# EAGLE design Audio-DAC-D (EAGLE 9.6.1)
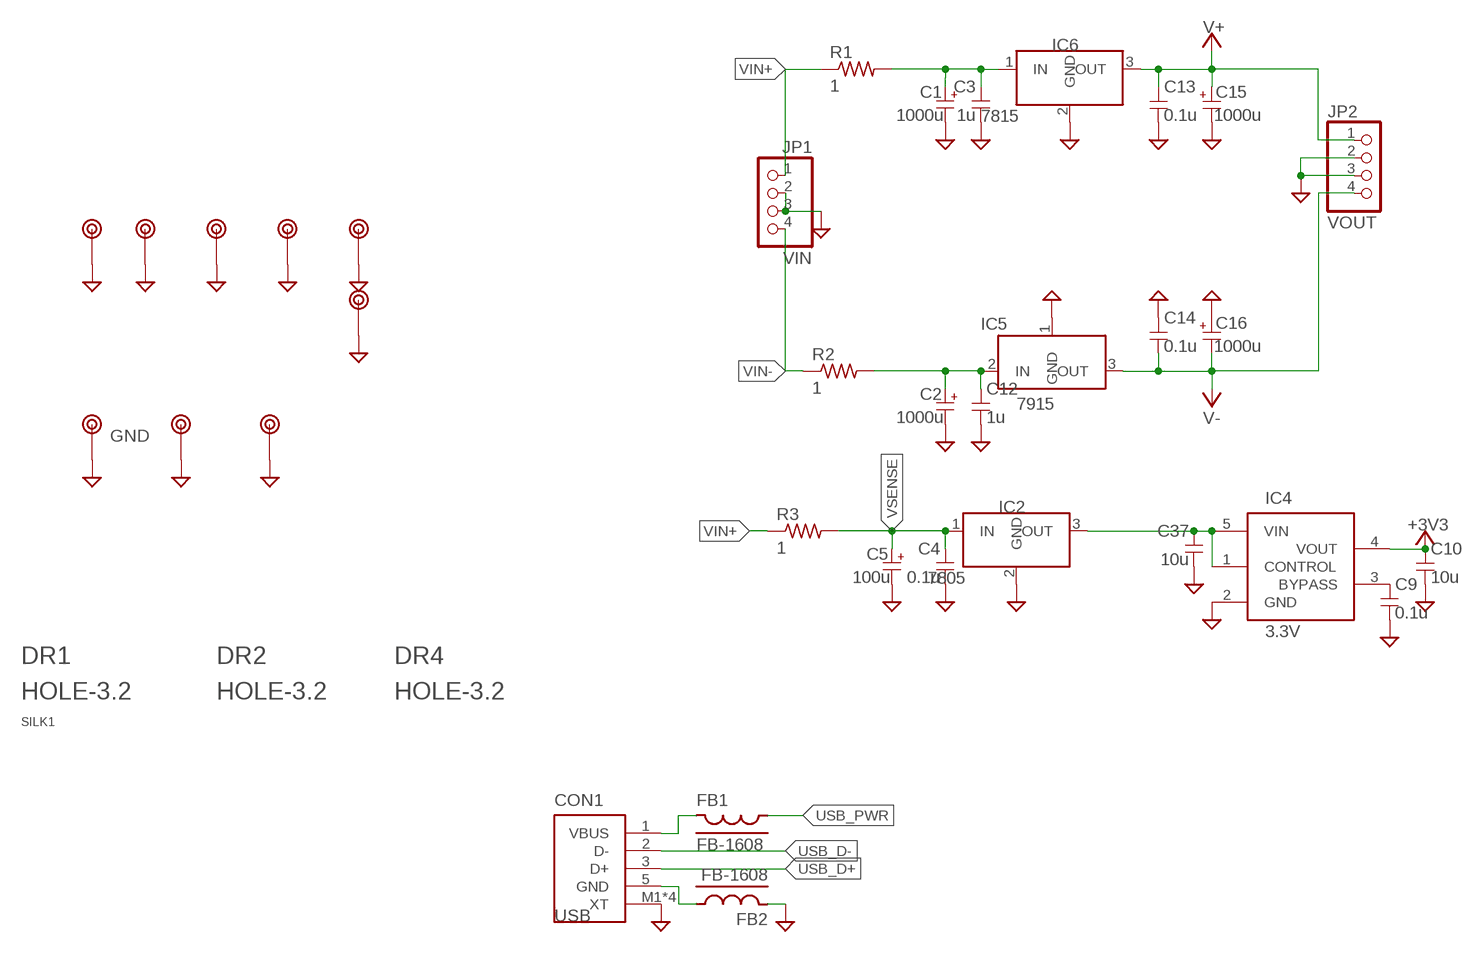
[diagram p0: schematic, sheet 1, part 1 of 2]
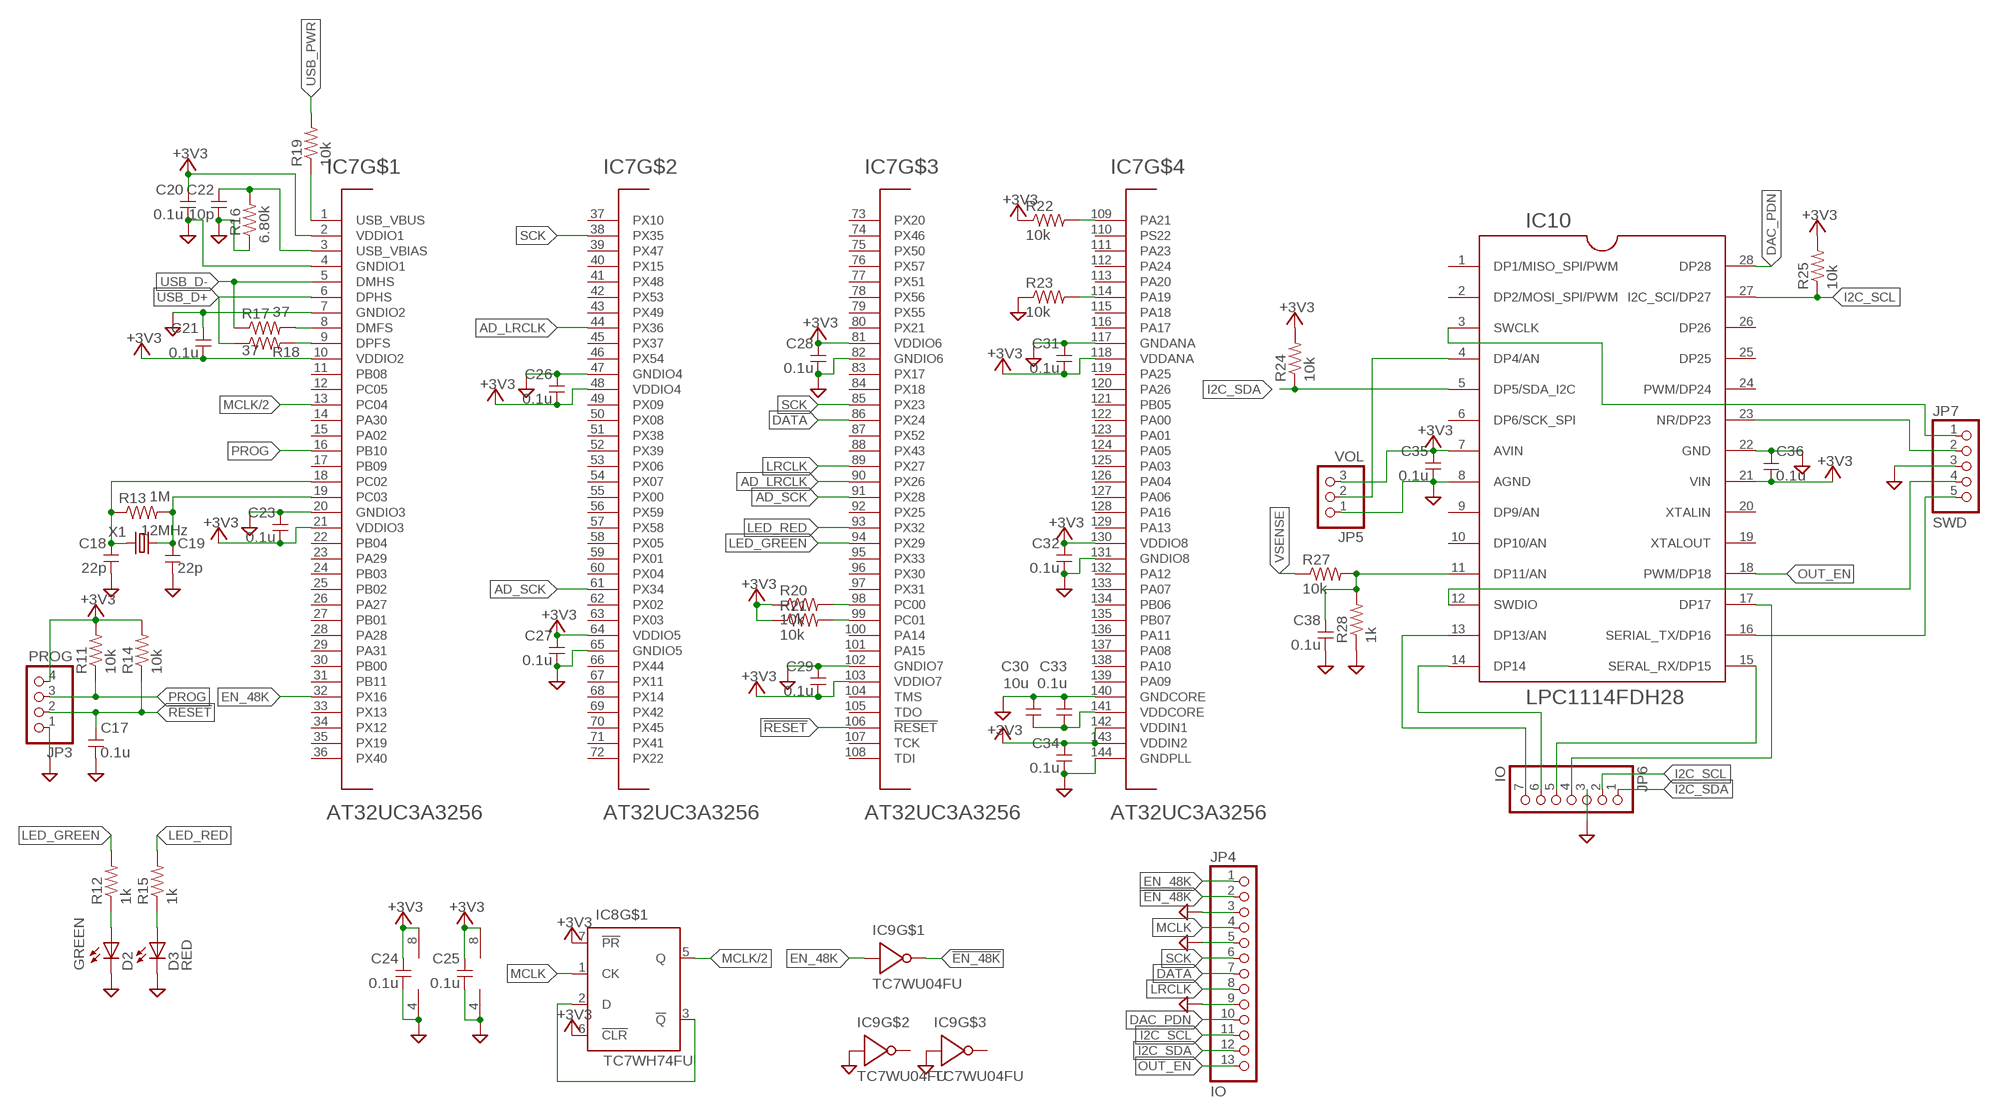
[diagram p1: schematic, sheet 1, part 2 of 2]

## Parts
C1  1000u  CPOLE5-10  [E5-10]
C2  1000u  CPOLE5-10  [E5-10]
C3  1u  C-1608  [1608]
C4  0.1u  C-1608  [1608]
C5  100u  CPOLE2.5-6.5  [E2.5-6.5]
C9  0.1u  C-1608  [1608]
C10  10u  C-2012  [2012]
C12  1u  C-1608  [1608]
C13  0.1u  C-2012  [2012]
C14  0.1u  C-2012  [2012]
C15  1000u  CPOLE5-10  [E5-10]
C16  1000u  CPOLE5-10  [E5-10]
C17  0.1u  C-1608  [1608]
C18  22p  C-1608  [1608]
C19  22p  C-1608  [1608]
C20  0.1u  C-1608  [1608]
C21  0.1u  C-1608  [1608]
C22  10p  C-1608  [1608]
C23  0.1u  C-1608  [1608]
C24  0.1u  C-1608  [1608]
C25  0.1u  C-1608  [1608]
C26  0.1u  C-1608  [1608]
C27  0.1u  C-1608  [1608]
C28  0.1u  C-1608  [1608]
C29  0.1u  C-1608  [1608]
C30  10u  C-2012  [2012]
C31  0.1u  C-1608  [1608]
C32  0.1u  C-1608  [1608]
C33  0.1u  C-1608  [1608]
C34  0.1u  C-1608  [1608]
C35  0.1u  C-1608  [1608]
C36  0.1u  C-1608  [1608]
C37  10u  C-2012  [2012]
C38  0.1u  C-1608  [1608]
CON1  USB  [UX60A-MB-5ST]
D2  GREEN  LED-SMD1608  [D1608]
D3  RED  LED-SMD1608  [D1608]
DR1  HOLE-3.2  [HOLE_3.2]
DR2  HOLE-3.2  [HOLE_3.2]
DR4  HOLE-3.2  [HOLE_3.2]
FB1  FB-1608  [1608]
FB2  FB-1608  [1608]
IC2  7805  78X-1  [7805-LARGEHOLE]
IC4  3.3V  NJM2863  [SOT23-5]
IC5  7915  79X-1  [7805-LARGEHOLE]
IC6  7815  78X-1  [7805-LARGEHOLE]
IC7  AT32UC3A3256  [TQFP144]
IC8  TC7WH74FU  [SSOP8-P-0.65]
IC9  TC7WU04FU  [SSOP8-P-0.65]
IC10  LPC1114FDH28  [TSSOP28]
JP1  VIN  PINHD-1X4  [1X04]
JP2  VOUT  PINHD-1X4  [1X04]
JP3  PROG  PINHD-1X4  [1X04]
JP4  IO  PINHD-1X13  [1X13]
JP5  VOL  PINHD-1X3  [1X03]
JP6  IO  PINHD-1X7  [1X07]
JP7  SWD  PINHD-1X5  [1X05]
R1  1  R-7.5  [0204/7]
R2  1  R-7.5  [0204/7]
R3  1  R-7.5  [0204/7]
R11  10k  R-1608  [1608]
R12  1k  R-1608  [1608]
R13  1M  R-7.5  [0204/7]
R14  10k  R-1608  [1608]
R15  1k  R-1608  [1608]
R16  6.80k  R-1608  [1608]
R17  37  R-1608  [1608]
R18  37  R-1608  [1608]
R19  10k  R-1608  [1608]
R20  10k  R-1608  [1608]
R21  10k  R-1608  [1608]
R22  10k  R-1608  [1608]
R23  10k  R-1608  [1608]
R24  10k  R-1608  [1608]
R25  10k  R-1608  [1608]
R27  10k  R-1608  [1608]
R28  1k  R-1608  [1608]
SILK1  ROBOTECHWHEELSILK-9MM  [ROBOTECHWHEEL-9MM]
TP1  TESTPIN  [TESTPIN]
TP2  GND  TESTPIN  [TESTPIN]
TP3  TESTPIN  [TESTPIN]
TP4  TESTPIN  [TESTPIN]
TP5  TESTPIN  [TESTPIN]
TP6  TESTPIN  [TESTPIN]
TP7  TESTPIN  [TESTPIN]
TP8  TESTPIN  [TESTPIN]
TP9  TESTPIN  [TESTPIN]
X1  12MHz  CRYSTALHC49S  [HC49/S]

## Nets
!EN_48K: IC9.7 JP4.2
!RESET: C17.1 IC7.106(!RESET) JP3.2 R14.1
+3V3: C10.1 C20.1 C21.2 C23.2 C24.1 C25.1 C26.2 C27.1 C28.1 C29.2 C31.2 C32.1 C34.1 C35.1 C36.2 IC4.4(VOUT) IC7.2(VDDIO1) IC7.10(VDDIO2) IC7.21(VDDIO3) IC7.48(VDDIO4) IC7.64(VDDIO5) IC7.81(VDDIO6) IC7.103(VDDIO7) IC7.118(VDDANA) IC7.130(VDDIO8) IC7.142(VDDIN1) IC7.143(VDDIN2) IC8.6(!CLR) IC8.7(!PR) IC8.8(V+) IC9.8(V+) IC10.7(AVIN) IC10.21(VIN) JP3.4 JP5.3 R11.2 R14.2 R20.1 R21.1 R22.1 R24.2 R25.2
AD_LRCLK: IC7.44(PX36) IC7.90(PX26)
AD_SCK: IC7.61(PX34) IC7.91(PX28)
DAC_PDN: IC10.28(DP28) JP4.10
DATA: IC7.86(PX24) JP4.7
EN_48K: IC7.32(PX16) IC9.1 JP4.1
GND: C1.- C2.- C3.2 C4.2 C5.- C9.2 C10.2 C12.2 C13.2 C14.1 C15.- C16.+ C17.2 C18.2 C19.2 C20.2 C21.1 C22.2 C23.1 C24.2 C25.2 C26.1 C27.2 C28.2 C29.1 C30.1 C31.1 C32.2 C33.1 C34.2 C35.2 C36.1 C37.2 C38.2 CON1.M1(XT) CON1.M2(XT) CON1.M3(XT) CON1.M4(XT) D2.K D3.K FB2.2 IC2.2(GND) IC4.2(GND) IC5.1(GND) IC6.2(GND) IC7.4(GNDIO1) IC7.7(GNDIO2) IC7.20(GNDIO3) IC7.47(GNDIO4) IC7.65(GNDIO5) IC7.82(GNDIO6) IC7.102(GNDIO7) IC7.117(GNDANA) IC7.131(GNDIO8) IC7.140(GNDCORE) IC7.144(GNDPLL) IC8.4(V-) IC9.3 IC9.4(V-) IC9.6 IC10.8(AGND) IC10.22(GND) JP1.2 JP1.3 JP2.2 JP2.3 JP3.1 JP4.3 JP4.5 JP4.9 JP5.1 JP6.3 JP7.3 R16.1 R23.1 R28.1 TP1.1 TP2.1 TP3.1 TP4.1 TP5.1 TP6.1 TP7.1 TP8.1 TP9.1
I2C_SCL: IC10.27(I2C_SCI/DP27) JP4.11 JP6.2 R25.1
I2C_SDA: IC10.5(DP5/SDA_I2C) JP4.12 JP6.1 R24.1
LED_GREEN: IC7.94(PX29) R12.2
LED_RED: IC7.93(PX32) R15.2
LRCLK: IC7.89(PX27) JP4.8
MCLK: IC8.1(CK) JP4.4
MCLK/2: IC7.13(PC04) IC8.5(Q)
N$1: CON1.5(GND) FB2.1
N$3: IC10.4(DP4/AN) JP5.2
N$4: C9.1 IC4.3(BYPASS)
N$5: C37.1 IC2.3(OUT) IC4.1(CONTROL) IC4.5(VIN)
N$6: IC7.9(DPFS) R18.2
N$7: IC7.8(DMFS) R17.2
N$8: C22.1 IC7.3(USB_VBIAS) R16.2
N$9: C19.1 IC7.19(PC03) R13.2 X1.1
N$10: C18.1 IC7.18(PC02) R13.1 X1.2
N$11: IC7.109(PA21) R22.2
N$12: IC7.114(PA19) R23.2
N$17: C38.1 IC10.11(DP11/AN) R27.2 R28.2
N$18: IC7.99(PC01) R21.2
N$19: IC7.98(PC00) R20.2
N$26: C30.2 C33.2 IC7.141(VDDCORE)
N$59: C1.+ C3.1 IC6.1(IN) R1.2
N$82: C2.+ C12.1 IC5.2(IN) R2.2
N$87: IC7.1(USB_VBUS) R19.1
N$90: IC8.2(D) IC8.3(!Q)
N$92: D2.A R12.1
N$93: D3.A R15.1
N$94: IC10.3(SWCLK) JP7.1
N$95: IC10.23(NR/DP23) JP7.2
N$96: IC10.12(SWDIO) JP7.4
N$97: IC10.16(SERIAL_TX/DP16) JP7.5
N$98: IC10.13(DP13/AN) JP6.7
N$99: IC10.14(DP14) JP6.6
N$100: IC10.15(SERAL_RX/DP15) JP6.5
N$101: IC10.17(DP17) JP6.4
OUT_EN: IC10.18(PWM/DP18) JP4.13
PROG: IC7.16(PB10) JP3.3 R11.1
SCK: IC7.38(PX35) IC7.85(PX23) JP4.6
USB_D+: CON1.3(D+) IC7.6(DPHS) R18.1
USB_D-: CON1.2(D-) IC7.5(DMHS) R17.1
USB_PWR: FB1.1 R19.2
V+: C13.1 C15.+ IC6.3(OUT) JP2.1
V-: C14.2 C16.- IC5.3(OUT) JP2.4
VBUS: CON1.1(VBUS) FB1.2
VIN+: JP1.1 R1.1 R3.1
VIN-: JP1.4 R2.1
VSENSE: C4.1 C5.+ IC2.1(IN) R3.2 R27.1
Unconnected: IC7.11(PB08) IC7.12(PC05) IC7.14(PA30) IC7.15(PA02) IC7.17(PB09) IC7.22(PB04) IC7.23(PA29) IC7.24(PB03) IC7.25(PB02) IC7.26(PA27) IC7.27(PB01) IC7.28(PA28) IC7.29(PA31) IC7.30(PB00) IC7.31(PB11) IC7.33(PX13) IC7.34(PX12) IC7.35(PX19) IC7.36(PX40) IC7.37(PX10) IC7.39(PX47) IC7.40(PX15) IC7.41(PX48) IC7.42(PX53) IC7.43(PX49) IC7.45(PX37) IC7.46(PX54) IC7.49(PX09) IC7.50(PX08) IC7.51(PX38) IC7.52(PX39) IC7.53(PX06) IC7.54(PX07) IC7.55(PX00) IC7.56(PX59) IC7.57(PX58) IC7.58(PX05) IC7.59(PX01) IC7.60(PX04) IC7.62(PX02) IC7.63(PX03) IC7.66(PX44) IC7.67(PX11) IC7.68(PX14) IC7.69(PX42) IC7.70(PX45) IC7.71(PX41) IC7.72(PX22) IC7.73(PX20) IC7.74(PX46) IC7.75(PX50) IC7.76(PX57) IC7.77(PX51) IC7.78(PX56) IC7.79(PX55) IC7.80(PX21) IC7.83(PX17) IC7.84(PX18) IC7.87(PX52) IC7.88(PX43) IC7.92(PX25) IC7.95(PX33) IC7.96(PX30) IC7.97(PX31) IC7.100(PA14) IC7.101(PA15) IC7.104(TMS) IC7.105(TDO) IC7.107(TCK) IC7.108(TDI) IC7.110(PS22) IC7.111(PA23) IC7.112(PA24) IC7.113(PA20) IC7.115(PA18) IC7.116(PA17) IC7.119(PA25) IC7.120(PA26) IC7.121(PB05) IC7.122(PA00) IC7.123(PA01) IC7.124(PA05) IC7.125(PA03) IC7.126(PA04) IC7.127(PA06) IC7.128(PA16) IC7.129(PA13) IC7.132(PA12) IC7.133(PA07) IC7.134(PB06) IC7.135(PB07) IC7.136(PA11) IC7.137(PA08) IC7.138(PA10) IC7.139(PA09) IC9.2 IC9.5 IC10.1(DP1/MISO_SPI/PWM) IC10.2(DP2/MOSI_SPI/PWM) IC10.6(DP6/SCK_SPI) IC10.9(DP9/AN) IC10.10(DP10/AN) IC10.19(XTALOUT) IC10.20(XTALIN) IC10.24(PWM/DP24) IC10.25(DP25) IC10.26(DP26)

## Library data of the parts
C1 C2 C5 C15 C16 = my_rcl:CPOL
C3 C4 C9 C10 C12-C14 C17-C38 = my_rcl:C
CON1 = my_connector:USB
D2 D3 = my_rcl:LED
DR1 DR2 DR4 = my_connector:HOLE-3.2
FB1 FB2 = my_rcl:FB
IC2 IC6 = my_ic:78X
IC4 = my_ic:NJM2863
IC5 = my_ic:79X
IC7 = my_ic:AT32UC3A3256
IC8 = my_ic:TC7WH74FU
IC9 = my_ic:TC7WU04FU
IC10 = my_ic:LPC1114
JP1-JP3 = pinhead:PINHD-1X4: PIN HEADER
JP4 = pinhead:PINHD-1X13: PIN HEADER
JP5 = pinhead:PINHD-1X3: PIN HEADER
JP6 = pinhead:PINHD-1X7: PIN HEADER
JP7 = pinhead:PINHD-1X5: PIN HEADER
R1-R3 R11-R25 R27 R28 = my_rcl:R
SILK1 = Document_Robotech:ROBOTECHWHEEL
TP1-TP9 = my_connector:TESTPIN
X1 = my_rcl:CRYSTAL: CRYSTAL

## Board
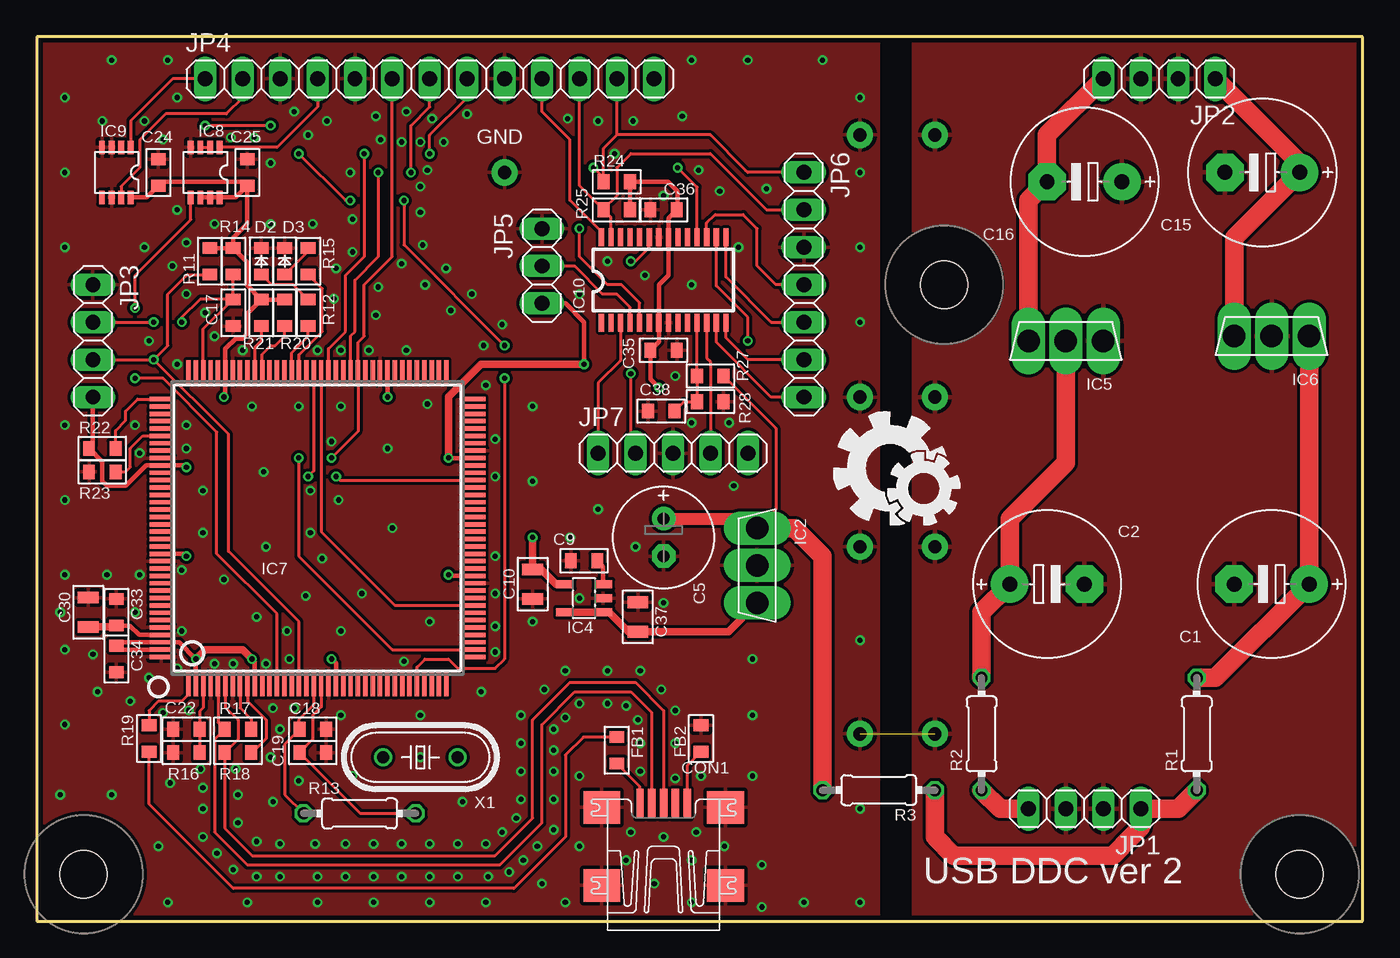
[diagram p2: board, top side]
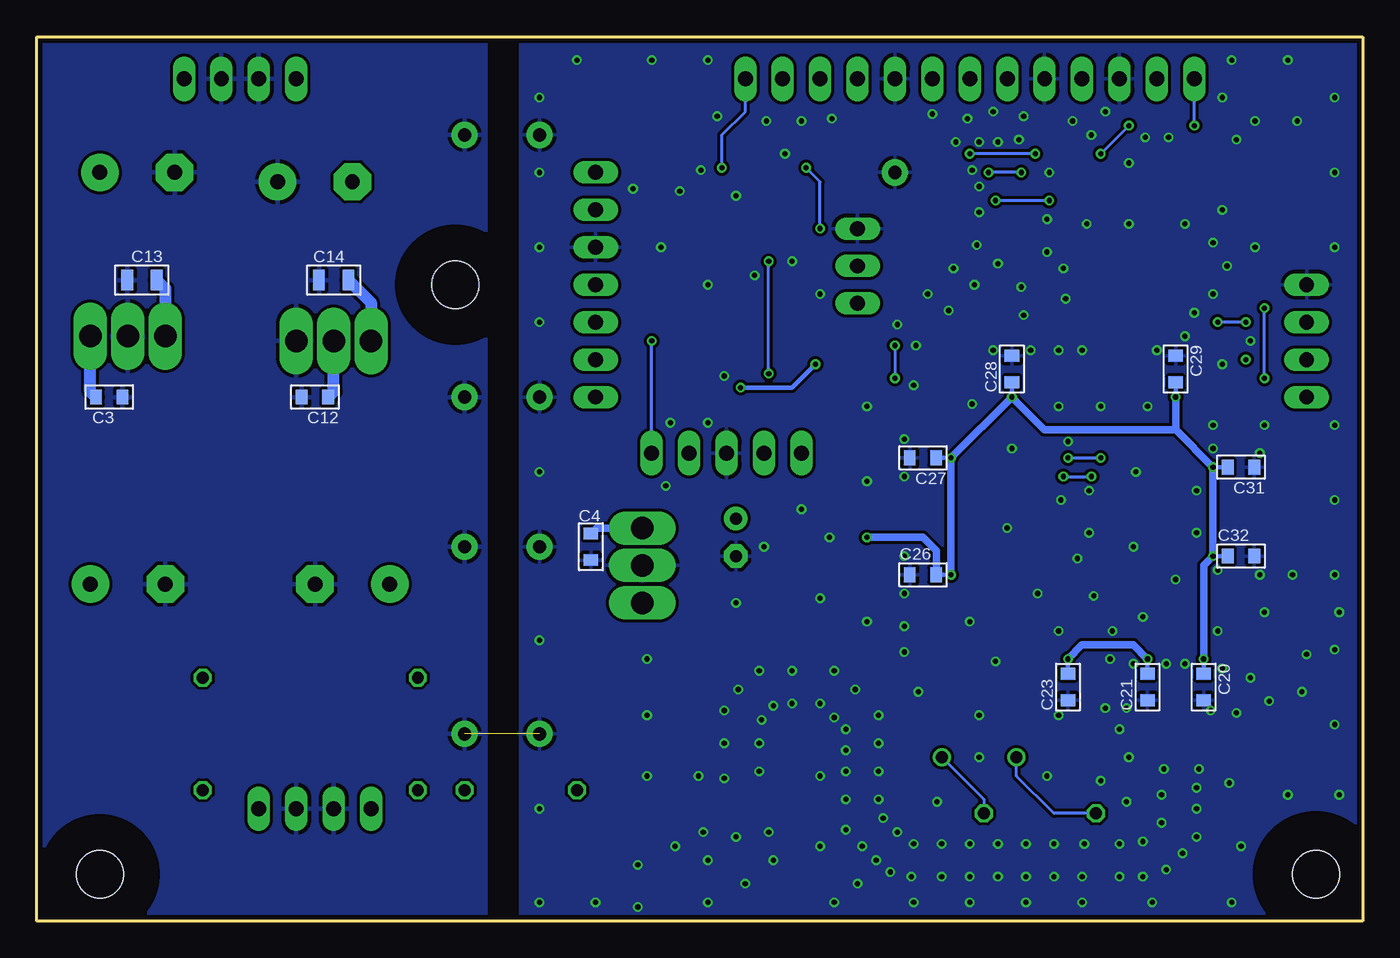
[diagram p3: board, bottom side, seen from below]

Size 90 x 60 mm. Coordinates in mm from the lower left corner, seen from the top.
Outline: 0,0 90,0 90,60 0,60 0,0
Copper layers (1*16): Top 0.035mm / dielectric 1.5mm / Bottom 0.035mm
Design rules "SeeedStudio_2layer_DRU_20140221 *": minimum track width 6mil, minimum drill 0.3mm, track to track 8mil, track to pad 7mil, pad to pad 7mil, via to via 12mil, smd to smd 0mil, copper to edge 0.3mm, drill to drill 10mil, minimum pad ring 0.15mm, minimum via ring 6mil, stop-mask expansion 2mil, vias tented up to drill 1mm, thermal gap 10mil

### Footprints (pad centres in the part's own frame; a part is rotated, then mirrored left to right if it is on the bottom)
E5-10 = drill 1.016 pad 2.54: + -2.54,0 | drill 1.016 pad 2.54 octagon: - 2.54,0
1608 = smd 0.8 x 1: 1 -0.9,0; 2 0.9,0
E2.5-6.5 = drill 0.813 pad 1.6: + -1.27,0 | drill 0.813 pad 1.6 octagon: - 1.27,0
2012 = smd 0.8 x 1.4: 1 -1,0; 2 1,0
UX60A-MB-5ST = smd 2 x 0.5: 1 2.25,1.6; 2 2.25,0.8; 3 2.25,0; 4 2.25,-0.8; 5 2.25,-1.6 | smd 2.2 x 2.5: M1 -3.3,-4.2; M2 -3.3,4.2; M3 2,4.2; M4 2,-4.2
D1608 = smd 0.8 x 1: A 0.9,0; K -0.9,0
HOLE_3.2 = hole 3.2: 0,0
7805-LARGEHOLE = drill 1.524 pad 2.032 long: 1 -2.54,0; 2 0,0; 3 2.54,0
SOT23-5 = smd 0.55 x 1.2: 1 -0.95,-1.3; 2 0,-1.3; 3 0.95,-1.3; 4 0.95,1.3; 5 -0.95,1.3
TQFP144 = smd 0.3 x 1.6: 1 -8.75,-10.6; 2 -8.25,-10.6; 3 -7.75,-10.6; 4 -7.25,-10.6; 5 -6.75,-10.6; 6 -6.25,-10.6; 7 -5.75,-10.6; 8 -5.25,-10.6; 9 -4.75,-10.6; 10 -4.25,-10.6; 11 -3.75,-10.6; 12 -3.25,-10.6; 13 -2.75,-10.6; 14 -2.25,-10.6; 15 -1.75,-10.6; 16 -1.25,-10.6; 17 -0.75,-10.6; 18 -0.25,-10.6; 19 0.25,-10.6; 20 0.75,-10.6; 21 1.25,-10.6; 22 1.75,-10.6; 23 2.25,-10.6; 24 2.75,-10.6; 25 3.25,-10.6; 26 3.75,-10.6; 27 4.25,-10.6; 28 4.75,-10.6; 29 5.25,-10.6; 30 5.75,-10.6; 31 6.25,-10.6; 32 6.75,-10.6; 33 7.25,-10.6; 34 7.75,-10.6; 35 8.25,-10.6; 36 8.75,-10.6; 73 8.75,10.6; 74 8.25,10.6; 75 7.75,10.6; 76 7.25,10.6; 77 6.75,10.6; 78 6.25,10.6; 79 5.75,10.6; 80 5.25,10.6; 81 4.75,10.6; 82 4.25,10.6; 83 3.75,10.6; 84 3.25,10.6; 85 2.75,10.6; 86 2.25,10.6; 87 1.75,10.6; 88 1.25,10.6; 89 0.75,10.6; 90 0.25,10.6; 91 -0.25,10.6; 92 -0.75,10.6; 93 -1.25,10.6; 94 -1.75,10.6; 95 -2.25,10.6; 96 -2.75,10.6; 97 -3.25,10.6; 98 -3.75,10.6; 99 -4.25,10.6; 100 -4.75,10.6; 101 -5.25,10.6; 102 -5.75,10.6; 103 -6.25,10.6; 104 -6.75,10.6; 105 -7.25,10.6; 106 -7.75,10.6; 107 -8.25,10.6; 108 -8.75,10.6 | smd 1.6 x 0.3: 37 10.6,-8.75; 38 10.6,-8.25; 39 10.6,-7.75; 40 10.6,-7.25; 41 10.6,-6.75; 42 10.6,-6.25; 43 10.6,-5.75; 44 10.6,-5.25; 45 10.6,-4.75; 46 10.6,-4.25; 47 10.6,-3.75; 48 10.6,-3.25; 49 10.6,-2.75; 50 10.6,-2.25; 51 10.6,-1.75; 52 10.6,-1.25; 53 10.6,-0.75; 54 10.6,-0.25; 55 10.6,0.25; 56 10.6,0.75; 57 10.6,1.25; 58 10.6,1.75; 59 10.6,2.25; 60 10.6,2.75; 61 10.6,3.25; 62 10.6,3.75; 63 10.6,4.25; 64 10.6,4.75; 65 10.6,5.25; 66 10.6,5.75; 67 10.6,6.25; 68 10.6,6.75; 69 10.6,7.25; 70 10.6,7.75; 71 10.6,8.25; 72 10.6,8.75; 109 -10.6,8.75; 110 -10.6,8.25; 111 -10.6,7.75; 112 -10.6,7.25; 113 -10.6,6.75; 114 -10.6,6.25; 115 -10.6,5.75; 116 -10.6,5.25; 117 -10.6,4.75; 118 -10.6,4.25; 119 -10.6,3.75; 120 -10.6,3.25; 121 -10.6,2.75; 122 -10.6,2.25; 123 -10.6,1.75; 124 -10.6,1.25; 125 -10.6,0.75; 126 -10.6,0.25; 127 -10.6,-0.25; 128 -10.6,-0.75; 129 -10.6,-1.25; 130 -10.6,-1.75; 131 -10.6,-2.25; 132 -10.6,-2.75; 133 -10.6,-3.25; 134 -10.6,-3.75; 135 -10.6,-4.25; 136 -10.6,-4.75; 137 -10.6,-5.25; 138 -10.6,-5.75; 139 -10.6,-6.25; 140 -10.6,-6.75; 141 -10.6,-7.25; 142 -10.6,-7.75; 143 -10.6,-8.25; 144 -10.6,-8.75
SSOP8-P-0.65 = smd 0.4 x 0.9: 1 -0.975,-1.7; 2 -0.325,-1.7; 3 0.325,-1.7; 4 0.975,-1.7; 5 0.975,1.7; 6 0.325,1.7; 7 -0.325,1.7; 8 -0.975,1.7
TSSOP28 = smd 0.35 x 1.2: 1 -4.225,-2.9; 2 -3.575,-2.9; 3 -2.925,-2.9; 4 -2.275,-2.9; 5 -1.625,-2.9; 6 -0.975,-2.9; 7 -0.325,-2.9; 8 0.325,-2.9; 9 0.975,-2.9; 10 1.625,-2.9; 11 2.275,-2.9; 12 2.925,-2.9; 13 3.575,-2.9; 14 4.225,-2.9; 15 4.225,2.9; 16 3.575,2.9; 17 2.925,2.9; 18 2.275,2.9; 19 1.625,2.9; 20 0.975,2.9; 21 0.325,2.9; 22 -0.325,2.9; 23 -0.975,2.9; 24 -1.625,2.9; 25 -2.275,2.9; 26 -2.925,2.9; 27 -3.575,2.9; 28 -4.225,2.9
1X04 = drill 1.016 long: 1 -3.81,0; 2 -1.27,0; 3 1.27,0; 4 3.81,0
1X13 = drill 1.016 long: 1 -15.24,0; 2 -12.7,0; 3 -10.16,0; 4 -7.62,0; 5 -5.08,0; 6 -2.54,0; 7 0,0; 8 2.54,0; 9 5.08,0; 10 7.62,0; 11 10.16,0; 12 12.7,0; 13 15.24,0
1X03 = drill 1.016 long: 1 -2.54,0; 2 0,0; 3 2.54,0
1X07 = drill 1.016 long: 1 -7.62,0; 2 -5.08,0; 3 -2.54,0; 4 0,0; 5 2.54,0; 6 5.08,0; 7 7.62,0
1X05 = drill 1.016 long: 1 -5.08,0; 2 -2.54,0; 3 0,0; 4 2.54,0; 5 5.08,0
0204/7 = drill 0.813 octagon: 1 -3.81,0; 2 3.81,0
TESTPIN = drill 0.9 pad 1.778: 1 0,0
HC49/S = drill 0.813: 1 -2.54,0; 2 2.54,0

### Placement (x,y rotation side)
C1  83.82,22.86 180 top
C2  68.58,22.86 0 top
C3  85.09,35.56 0 bottom
C4  52.39,25.4 270 bottom
C5  42.55,26.04 270 top
C9  37.15,24.45 180 top
C10  33.66,22.86 270 top
C12  71.12,35.56 180 bottom
C13  82.87,43.5 180 bottom
C14  69.85,43.5 0 bottom
C15  83.19,50.8 180 top
C16  71.12,50.16 180 top
C17  13.34,41.27 270 top
C18  18.73,13.02 0 top
C19  18.73,11.43 0 top
C20  10.79,15.88 270 bottom
C21  14.61,15.88 90 bottom
C22  10.16,13.02 180 top
C23  20,15.88 90 bottom
C24  8.26,50.8 90 top
C25  14.29,50.8 90 top
C26  29.84,23.5 0 bottom
C27  29.84,31.43 180 bottom
C28  23.81,37.47 90 bottom
C29  12.7,37.47 270 bottom
C30  3.49,20.95 270 top
C31  8.26,30.8 180 bottom
C32  8.26,24.77 0 bottom
C33  5.4,20.95 270 top
C34  5.4,17.78 270 top
C35  42.55,38.73 0 top
C36  42.55,48.26 0 top
C37  40.8,20.64 90 top
C38  42.39,34.61 180 top
CON1  42.55,5.71 90 top
D2  15.24,44.77 270 top
D3  16.83,44.77 270 top
DR1  3.17,3.17 0 top
DR2  61.59,43.18 0 top
DR4  85.72,3.17 0 top
FB1  39.37,11.59 270 top
FB2  45.09,12.38 90 top
IC2  48.9,24.13 270 top
IC4  37.15,21.91 90 top
IC5  69.85,39.37 180 top
IC6  83.82,39.69 180 top
IC7  19.05,26.67 0 top
IC8  11.43,50.8 180 top
IC9  5.4,50.8 180 top
IC10  42.55,43.5 0 top
JP1  71.12,7.62 180 top
JP2  76.2,57.15 180 top
JP3  3.81,39.37 270 top
JP4  26.67,57.15 0 top
JP5  34.29,44.45 270 top
JP6  52.07,43.18 270 top
JP7  43.18,31.75 0 top
R1  78.74,12.7 90 top
R2  64.14,12.7 90 top
R3  57.15,8.89 180 top
R11  11.75,44.77 90 top
R12  18.41,41.27 270 top
R13  21.91,7.3 0 top
R14  13.34,44.77 90 top
R15  18.41,44.77 270 top
R16  10.16,11.43 0 top
R17  13.65,13.02 0 top
R18  13.65,11.43 0 top
R19  7.62,12.38 270 top
R20  16.83,41.27 270 top
R21  15.24,41.27 270 top
R22  4.45,32.07 0 top
R23  4.45,30.48 0 top
R24  39.37,50.16 0 top
R25  39.37,48.26 0 top
R27  45.72,36.99 180 top
R28  45.72,35.24 180 top
SILK1  53.98,26.67 0 top
TP1  60.96,25.4 0 top
TP2  31.75,50.8 0 top
TP3  60.96,12.7 0 top
TP4  55.88,12.7 0 top
TP5  55.88,25.4 0 top
TP6  55.88,35.56 0 top
TP7  60.96,35.56 0 top
TP8  55.88,53.34 0 top
TP9  60.96,53.34 0 top
X1  26.04,11.11 180 top

### Tracks (layer width: path | path; a pad name or v marks a point on that pad's centre or on a via)
!EN_48K
  Top 0.203: JP4.2 13.97,55.88 12.86,54.77 8.73,54.77 6.99,53.02 6.99,51.12 5.71,49.85 IC9.7
!RESET  (via drill 0.35)
  Top 0.203: 13.34,42.23 C17.1 13.28,42.17 11.3,40.19 IC7.106 | 13.34,42.23 R14.1 | JP3.2 v7.94,40.64 | v9.84,40.64 9.84,40.96 11.11,42.23 13.34,42.23
  Bottom 0.203: v7.94,40.64 v9.84,40.64
+3V3  (via drill 0.35)
  Top 0.305: R25.2 R24.2 42.86,50.16 43.5,49.53 43.5,48.31 C36.2 42.87,47.69 IC10.21 42.87,43.82 42.22,43.17 IC10.7 42.22,39.31 C35.1 41.65,36.78 v42.23,36.2 | v37.15,37.78 37.15,40.64 35.88,41.91 JP5.3 | R21.1 14.29,41.22 14.29,39.85 13.97,39.53 13.49,39.53 12.8,38.84 IC7.103 12.8,35.66 v12.7,35.56 | R21.1 R20.1 | R21.1 14.29,43.13 14.29,44.72 R14.2 | R11.2 R14.2 | JP3.4 3.81,32.33 R22.1 4.45,31.17 4.45,29.84 4.76,29.53 6.03,29.53 7.42,30.92 IC7.118 10.04,30.92 v10.16,30.8 | IC7.130 10.01,24.92 v10.16,24.77 | IC7.2 v10.79,17.78 9.65,18.92 IC7.142 5.64,18.92 C34.1 5.66,18.42 IC7.143 | IC7.10 14.8,17.59 v14.61,17.78 | IC7.21 20.3,17.48 v20,17.78 | IC7.48 28.02,23.42 v27.94,23.5 | IC7.64 27.95,31.42 v27.94,31.43 | IC7.81 23.8,35.57 v23.81,35.56 | IC9.8 7.46,49.1 C24.1 8.52,50.16 14.02,50.16 C25.1 | C25.1 13.49,49.1 IC8.8 IC8.7 IC8.6 | C25.1 14.29,47.31 13.34,46.35 R14.2
  Top 0.508: IC4.4 35.24,22.86 34.24,23.86 C10.1 v33.66,26.04 | 27.95,31.42 27.95,35.57 30.16,37.78 v37.15,37.78 | v14.61,17.78 13.97,18.41 11.43,18.41 v10.79,17.78
  Bottom 0.305: v42.23,36.2 38.73,36.2 v37.15,37.78 | v12.7,35.56 C29.2 | v10.16,30.8 C31.2 | v10.16,24.77 C32.1 | v10.79,17.78 C20.1 | v14.61,17.78 C21.2 | v20,17.78 C23.2 | C26.2 v27.94,23.5 | v27.94,31.43 C27.1 | v23.81,35.56 C28.1
  Bottom 0.508: 12.7,33.34 v10.16,30.8 v10.16,24.77 10.79,24.13 v10.79,17.78 | v27.94,23.5 v27.94,31.43 v23.81,35.56 21.59,33.34 12.7,33.34 | v12.7,35.56 12.7,33.34 | v20,17.78 19.05,18.73 15.56,18.73 v14.61,17.78 | C26.2 28.95,25.14 29.84,26.04 v33.66,26.04
AD_LRCLK
  Top 0.203: IC7.90 19.3,26.42 24.3,21.42 IC7.44
AD_SCK  (via drill 0.35)
  Top 0.203: IC7.91 18.8,30.55 v18.41,30.16 | v20.32,30.16 20.56,29.92 IC7.61
  Bottom 0.203: v20.32,30.16 v18.41,30.16
DAC_PDN
  Top 0.203: IC10.28 38.32,46.77 36.2,48.9 36.2,50.48 36.2,50.8 36.2,53.02 34.29,54.93 JP4.10
DATA  (via drill 0.35)
  Top 0.203: IC7.86 21.3,39.72 21.59,40.01 21.59,43.5 23.18,45.09 v23.18,50.8 | v25.4,50.8 25.4,53.98 26.67,55.24 JP4.7
  Bottom 0.203: v23.18,50.8 v25.4,50.8
EN_48K  (via drill 0.35)
  Top 0.203: JP4.1 9.21,57.15 6.37,54.31 IC9.1 | IC7.32 25.8,17.23 26.35,17.78 27.94,17.78 28.57,17.14 31.11,17.14 31.75,17.78 v31.75,36.83 | v31.75,39.05 24.92,45.88 v24.92,48.9 | v21.27,48.9 20.95,48.9 v17.78,52.07 | v15.88,53.98 v11.43,53.98
  Bottom 0.203: v24.92,48.9 v21.27,48.9 | v17.78,52.07 v15.88,53.98 | v11.43,53.98 JP4.1 | v31.75,39.05 v31.75,36.83
GND  (via drill 0.35)  (1 unrouted)
  other vias: 44.45,43.18 41.27,43.81 38.73,44.77 13.34,17.46 12.06,17.46 24.13,26.67 14.61,34.92 12.06,39.69 6.99,31.75 10.16,32.07 6.99,23.5 9.84,23.81 9.84,19.68 6.67,20.95 7.62,16.51 9.53,17.14 17.14,17.78 20.64,13.97 31.11,22.23 31.11,24.77 26.67,20.32 20.64,34.92 31.11,32.7 22.54,38.73 25.08,38.73 13.97,38.73 12.06,47.31 9.21,44.45 10.16,42.55 33.66,20.32 42.55,49.21 43.34,9.68 43.34,12.06 43.34,14.29 42.39,15.72 40.96,16.99 38.73,16.99 35.88,16.99 34.45,15.72 32.86,13.97 32.86,12.06 32.86,10.16 32.86,8.26 32.54,6.99 31.59,6.03 30.48,5.24 28.57,5.24 26.67,5.24 24.77,5.24 22.86,5.24 20.95,5.24 18.89,5.24 16.51,5.24 14.92,5.4 13.65,6.67 13.65,8.57 13.49,10.32 40.96,10.16 40.96,12.06 40.8,13.65 40.01,14.61 38.73,14.76 36.83,14.76 35.88,13.81 35.08,13.02 35.08,11.59 35.08,10.16 35.08,8.26 35.08,6.19 33.97,5.08 33.02,4.13 32.07,3.33 30.64,3.02 28.57,3.02 26.67,3.02 24.77,3.02 22.86,3.02 20.95,3.02 19.05,3.02 16.51,3.02 14.92,3.02 13.34,3.49 12.22,4.6 11.27,5.71 11.27,7.62 11.27,9.05 11.11,10.32 15.88,11.11 16.51,13.02 16.03,14.45 17.46,14.45 10.32,14.29 8.57,14.13 9.05,9.37 16.03,8.1 17.78,9.53 21.43,9.84 26.04,11.11 28.89,8.1 26.04,13.97 24.92,17.62 31.11,20 31.11,18.26 31.11,30.16 30.48,36.35 26.51,35.08 23.81,32.07 20,32.54 10.16,33.66 11.27,29.21 11.27,26.35 12.7,23.18 14.92,20.64 15.56,17.46 16.99,19.68 17.78,34.92 15.4,30.48 15.56,25.4 18.26,22.07 20.64,19.68 22.07,22.23 19.37,24.61 18.57,26.35 18.57,29.21 20.48,28.57 23.02,54.61 25.08,54.93 26.83,54.45 26.04,52.86 29.21,54.77 27.62,52.86 26.51,50.96 26.04,49.85 24.77,52.86 21.27,50.8 23.34,53.02 21.43,47.62 21.43,45.4 20.32,44.29 20.16,42.23 19.05,38.73 23.02,41.12 23.18,43.02 24.77,44.61 26.35,43.18 28.1,41.43 30.32,39.05 31.59,40.48 29.53,42.55 27.78,44.29 26.19,45.88 26.04,48.1 38.1,54.29 36.04,54.45 40.48,54.29 43.81,54.61 39.21,52.07 49.53,49.69 44.93,50.96 46.35,49.53 33.66,34.92 33.66,29.84 36.2,26.04 40.64,25.4 36.83,21.91 42.55,21.59 8.89,1.27 14.29,1.27 19.05,1.27 22.86,1.27 26.67,1.27 30.48,1.27 34.29,2.54 36.83,5.08 41.91,2.54 46.67,5.08 49.21,0.95 49.21,3.81 44.45,4.13 44.45,1.27 40.01,4.13 35.88,1.27 36.83,9.84 40.32,6.03 44.77,6.03 45.09,9.84 48.58,9.84 42.55,5.71 48.58,13.97 48.58,17.78 55.88,30.48 55.88,40.64 55.88,45.72 55.88,50.8 55.88,55.88 53.34,58.42 48.26,58.42 44.45,58.42 8.89,58.42 5.08,58.42 1.91,55.88 1.91,50.8 1.91,45.72 1.91,33.66 1.91,28.57 1.91,23.5 1.91,18.41 1.91,13.34 1.59,8.57 5.08,8.57 8.26,5.08 1.59,20.95 4.76,23.5 3.81,18.1 4.13,15.56 6.35,14.92 30.16,15.56 6.67,33.66 9.53,37.78 11.43,41.27 7.62,39.37 20.64,38.73 15.88,47.31 18.73,47.31 7.3,45.72 9.53,48.26 15.88,51.44 10.16,46.04 8.57,53.02 4.45,54.29 9.53,55.88 7.3,54.29 19.68,54.29 18.41,53.34 17.46,54.93 14.76,53.18 13.18,53.18 47.31,29.53 46.99,33.81 44.45,33.81 43.34,36.99 52.07,1.27 55.88,1.27 55.88,19.05 55.88,7.62 38.1,27.94 47.62,45.72 36.83,42.55
  pour Top (isolate 0.203): 0,60.01 0,0 57.15,0 57.15,60.01
  pour Bottom (isolate 0.203): 0,60.01 0,0 57.15,0 57.15,60.01
  pour Top: 59.53,60.33 59.53,0 90.17,0 90.17,60.33
  pour Bottom: 59.53,60.33 59.53,0 90.17,0 90.17,60.33
I2C_SCL
  Top 0.203: IC10.27 38.97,47.76 R25.1 38.44,48.29 | 38.44,48.29 36.83,49.9 JP4.11 | 38.44,48.29 39.37,49.21 39.37,51.12 40.32,52.07 45.72,52.07 49.53,48.26 JP6.2
I2C_SDA  (via drill 0.35)
  Top 0.203: 39.37,53.34 JP4.12 | 39.37,53.34 38.47,52.44 R24.1 38.47,50.43 v37.78,51.12 | IC10.5 40.92,41.95 39.69,43.18 38.73,43.18 36.83,45.09 v36.83,46.99 | 39.37,53.34 45.72,53.34 48.1,50.96 48.26,50.8 JP6.1
  Bottom 0.203: v36.83,46.99 36.83,50.16 v37.78,51.12
LED_GREEN
  Top 0.203: IC7.94 17.3,38.57 18.41,39.69 R12.2
LED_RED
  Top 0.203: IC7.93 17.8,38.44 19.37,40.01 19.37,42.91 R15.2
LRCLK  (via drill 0.35)
  Top 0.203: IC7.89 19.8,38.85 20.95,40.01 20.95,43.81 22.23,45.09 v22.23,52.07 | v26.67,52.07 26.67,53.34 29.21,55.88 JP4.8
  Bottom 0.203: v22.23,52.07 v26.67,52.07
MCLK
  Top 0.203: JP4.4 19.05,55.24 16.3,52.5 IC8.1
MCLK/2  (via drill 0.35)
  Top 0.203: IC7.13 16.3,20.85 12.22,24.92 12.22,33.18 8.57,36.83 v6.67,36.83 | v6.67,41.59 6.67,43.81 10.46,47.6 IC8.5
  Bottom 0.203: v6.67,36.83 v6.67,41.59
N$1
  Top 0.203: FB2.1 44.15,10.54 CON1.5
N$3
  Top 0.203: JP5.2 36.51,44.45 38.42,42.55 39.37,42.55 40.27,41.65 IC10.4
N$4
  Top 0.305: IC4.3 38.45,24.05 C9.1
N$5
  Top 0.508: IC4.5 IC4.1 38.84,20.96 40.16,19.64 C37.1 46.94,19.64 IC2.3
N$6
  Top 0.203: IC7.9 14.3,14.91 15.56,13.65 15.56,12.38 14.61,11.43 R18.2
N$7
  Top 0.203: IC7.8 13.8,14.46 14.55,13.71 R17.2
N$8
  Top 0.203: IC7.3 11.3,14.47 11.06,14.23 C22.1 R16.2
N$9
  Top 0.203: IC7.19 19.3,14.54 18.73,13.97 18.73,12.33 C19.1 21.96,7.3 R13.2
  Bottom 0.203: X1.1 25.72,8.26 R13.2
N$10
  Top 0.203: IC7.18 18.8,14.67 17.78,13.65 17.78,13.07 C18.1 16.83,12.01 16.83,8.57 R13.1
  Bottom 0.203: R13.1 20.95,7.3 23.5,9.84 X1.2
N$11
  Top 0.203: R22.2 5.34,33.28 6.03,33.97 6.03,34.61 6.84,35.42 IC7.109
N$12
  Top 0.203: R23.2 6.03,30.48 6.35,30.8 6.35,32.07 7.2,32.92 IC7.114
N$17
  Top 0.203: IC10.11 R27.2 R28.2 43.92,35.24 C38.1
N$18
  Top 0.203: R21.2 15.24,39.37 14.8,38.93 IC7.99
N$19
  Top 0.203: IC7.98 15.3,38.48 15.88,39.05 16.19,39.05 16.83,39.69 R20.2
N$26
  Top 0.305: IC7.141 6.93,19.42 6.3,20.05 C33.2
  Top 0.508: C30.2 5.3,19.95 C33.2
N$59
  Top 1.27: IC6.1 C1.+ 80.01,16.51 R1.2
  Bottom 0.813: C3.1 86.36,35.93 IC6.1
N$82
  Top 1.27: IC5.2 69.85,31.11 66.04,27.3 C2.+ 64.14,20.95 R2.2
  Bottom 0.813: C12.1 69.85,35.93 IC5.2
N$87
  Top 0.203: IC7.1 10.3,15.38 9.84,14.92 8.26,14.92 7.62,14.29 R19.1
N$90
  Top 0.203: IC8.3 IC8.2
N$92
  Top 0.203: R12.1 17.41,43.18 15.93,43.18 D2.A
N$93
  Top 0.203: D3.A 18.41,45.45 R15.1
N$94
  Top 0.203: IC10.3 39.62,38.03 38.1,36.51 JP7.1
N$95  (via drill 0.35)
  Top 0.203: JP7.2 40.32,32.07 v40.32,37.15 | v40.32,44.77 40.64,44.77 41.57,45.7 IC10.23
  Bottom 0.203: v40.32,37.15 v40.32,44.77
N$96
  Top 0.203: IC10.12 45.47,38.19 45.72,37.94 JP7.4
N$97  (via drill 0.35)
  Top 0.203: v48.26,39.37 48.26,40.96 46.12,43.1 IC10.16
  Bottom 0.203: JP7.5 v48.26,39.37
N$98
  Top 0.203: IC10.13 46.12,39.29 49.85,35.56 JP6.7
N$99
  Top 0.203: IC10.14 46.77,39.59 48.26,38.1 JP6.6
N$100
  Top 0.203: IC10.15 46.77,43.72 49.85,40.64 JP6.5
N$101
  Top 0.203: IC10.17 45.47,47.38 46.04,47.94 47.94,47.94 48.9,46.99 48.9,44.45 50.16,43.18 JP6.4
OUT_EN  (via drill 0.35)
  Top 0.203: IC10.18 44.82,49.8 v43.5,51.12
  Bottom 0.203: v43.5,51.12 43.5,53.34 41.91,54.93 JP4.13
PROG  (via drill 0.35)
  Top 0.203: JP3.3 v7.94,38.1 | v7.94,38.1 8.89,39.05 8.89,42.55 10.21,43.87 R11.1 | IC7.16 17.8,20.3 13.02,25.08 13.02,33.02 v7.94,38.1
SCK  (via drill 0.35)
  Top 0.203: JP4.6 24.13,45.09 22.23,43.18 22.23,39.69 21.8,39.26 IC7.85 21.8,33.23 v20,31.43 | v17.78,31.43 17.78,24.77 24.12,18.42 IC7.38
  Bottom 0.203: v20,31.43 v17.78,31.43
USB_D+
  Top 0.203: IC7.6 12.8,14.51 13.65,13.65 13.65,12.33 R18.1 12.75,6.3 14.61,4.45 31.11,4.45 33.66,6.99 33.66,13.65 36.2,16.19 40.64,16.19 42.55,14.29 CON1.3
USB_D-
  Top 0.203: IC7.5 12.3,13.47 R17.1 12.06,12.33 12.06,6.03 14.29,3.81 31.43,3.81 34.29,6.67 34.29,13.34 36.51,15.56 40.32,15.56 41.74,14.13 CON1.2
USB_PWR
  Top 0.203: FB1.1 37.09,12.49 35.88,11.27 35.88,5.71 32.38,2.22 13.34,2.22 7.62,7.94 R19.2
V+
  Top 1.27: JP2.1 85.72,51.44 C15.+ 81.28,46.35 IC6.3
  Bottom 0.813: C13.1 81.28,42.91 IC6.3
V-
  Top 1.27: JP2.4 68.58,53.34 C16.- 67.31,48.9 IC5.3
  Bottom 0.813: C14.2 67.31,41.96 IC5.3
VBUS
  Top 0.203: CON1.1 40.95,9.11 FB1.2
VIN+
  Top 1.27: R1.1 77.47,7.62 JP1.1 74.93,6.35 74.3,5.71 73.03,4.45 62.23,4.45 60.96,5.71 R3.1
VIN-
  Top 1.27: JP1.4 65.41,7.62 R2.1
VSENSE
  Top 0.203: R27.1 50.16,33.44 50.16,27.94 IC2.1
  Top 0.813: C5.+ 48.26,27.3 IC2.1
  Top 1.27: IC2.1 51.44,26.67 53.34,24.77 R3.2
  Bottom 0.508: IC2.1 52.02,26.67 C4.1

### Text on the board
tPlace: USB DDC ver 2